# Altium schematic sheet ATB-Display.SchDoc
size A4
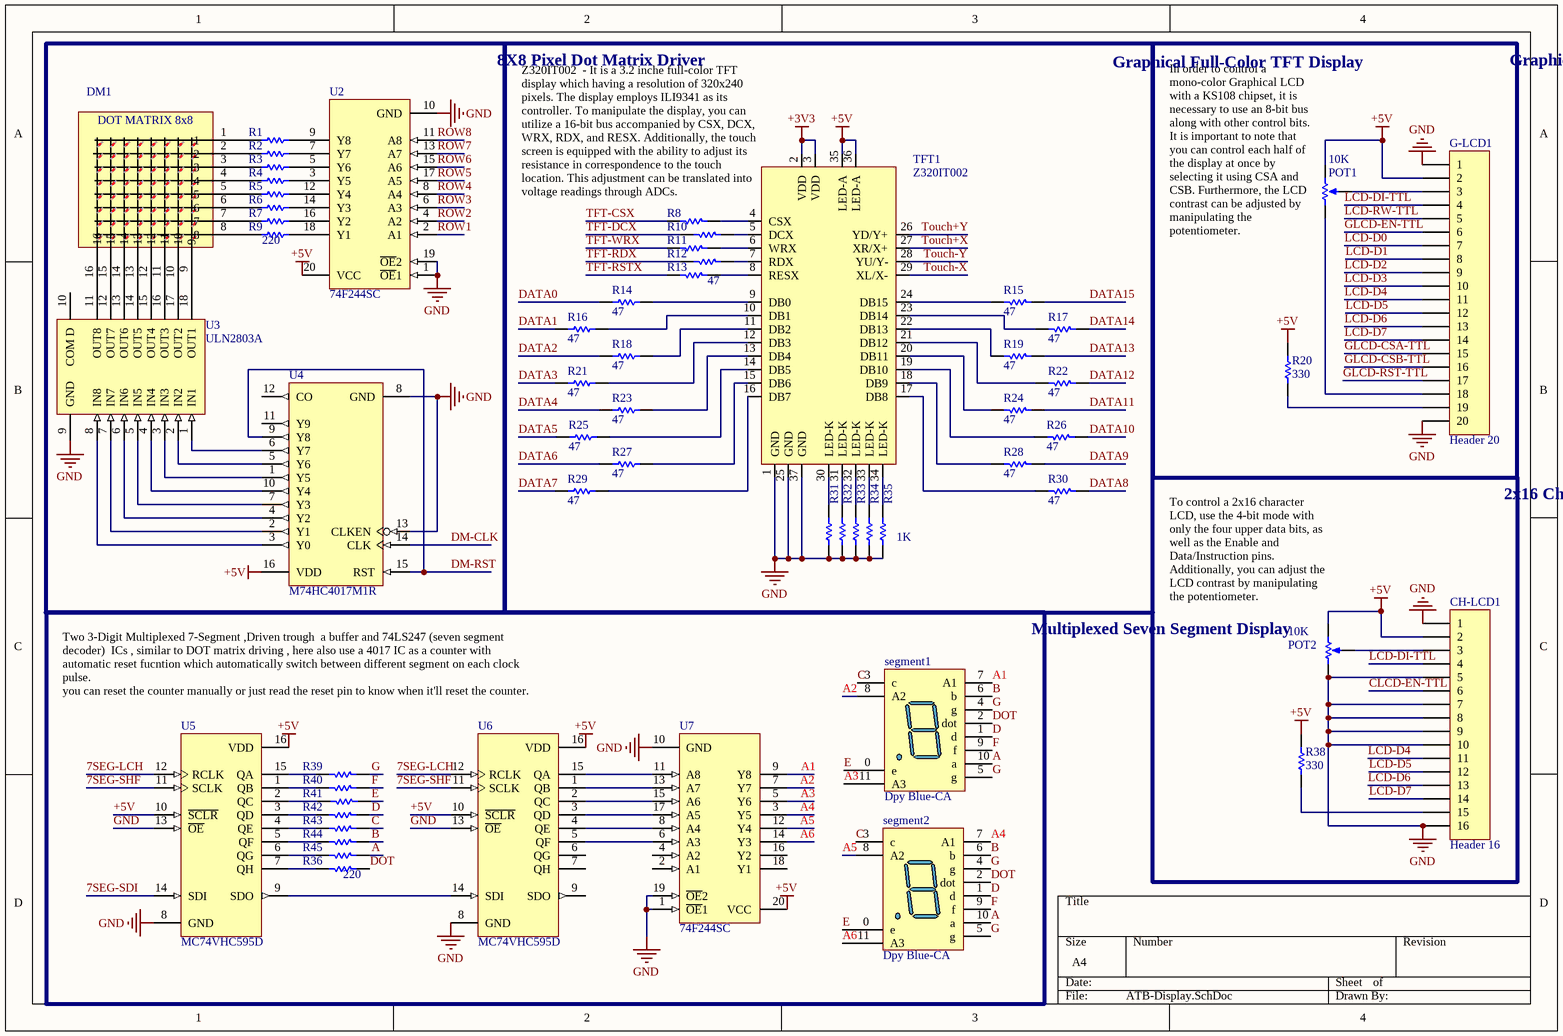
[diagram p0: ATB-Display.SchDoc]

## Parts
CH-LCD1  Header 16  [2X16 LCD]
DM1  DOT-8x8-32X32mm  [8x8 LED MATRIX]  (value not drawn)
G-LCD1  Header 20  [LCD-128X64-ST7920]
POT1  value 10K  [VR5]  (hidden comment: RPot)
POT2  value 10K  [VR5]  (hidden comment: RPot)
R1  220  [SMD_R0805]  (value not drawn)
R2  220  [SMD_R0805]  (value not drawn)
R3  220  [SMD_R0805]  (value not drawn)
R4  220  [SMD_R0805]  (value not drawn)
R5  220  [SMD_R0805]  (value not drawn)
R6  220  [SMD_R0805]  (value not drawn)
R7  220  [SMD_R0805]  (value not drawn)
R8  47  [SMD_R0805]
R9  220  [SMD_R0805]
R10  47  [SMD_R0805]  (value not drawn)
R11  47  [SMD_R0805]  (value not drawn)
R12  47  [SMD_R0805]  (value not drawn)
R13  47  [SMD_R0805]  (value not drawn)
R14  47  [SMD_R0805]
R15  47  [SMD_R0805]
R16  47  [SMD_R0805]
R17  47  [SMD_R0805]
R18  47  [SMD_R0805]
R19  47  [SMD_R0805]
R20  330  [SMD_R1206]
R21  47  [SMD_R0805]
R22  47  [SMD_R0805]
R23  47  [SMD_R0805]
R24  47  [SMD_R0805]
R25  47  [SMD_R0805]
R26  47  [SMD_R0805]
R27  47  [SMD_R0805]
R28  47  [SMD_R0805]
R29  47  [SMD_R0805]
R30  47  [SMD_R0805]
R31  1K  [SMD_R0805]  (value not drawn)
R32  1K  [SMD_R0805]  (value not drawn)
R33  1K  [SMD_R0805]  (value not drawn)
R34  1K  [SMD_R0805]  (value not drawn)
R35  1K  [SMD_R0805]
R36  220  [SMD_R0805]  (value not drawn)
R38  330  [SMD_R1206]
R39  220  [SMD_R0805]  (value not drawn)
R40  220  [SMD_R0805]  (value not drawn)
R41  220  [SMD_R0805]  (value not drawn)
R42  220  [SMD_R0805]  (value not drawn)
R43  220  [SMD_R0805]  (value not drawn)
R44  220  [SMD_R0805]
R45  220  [SMD_R0805]  (value not drawn)
segment1  Dpy Blue-CA  [7 segment Diode]
segment2  Dpy Blue-CA  [7 segment Diode]
TFT1  Z320IT002  [N96 COLOR LCD]
U2  74F244SC  [751D-04_N]
U3  ULN2803A  [so18_n]
U4  M74HC4017M1R  [SO16_N]
U5  MC74VHC595D  [751B-05_N]
U6  MC74VHC595D  [751B-05_N]
U7  74F244SC  [751D-04_N]

## Blocks framed on the sheet
8X8 Pixel Dot Matrix Driver: DM1 R1-R7 R9 U2-U4
Graphical Full-Color TFT Display: R8 R10-R19 R21-R35 TFT1
Graphical Mono Color LCD: G-LCD1 POT1 R20
Multiplexed Seven Segment Display: R36 R39-R45 segment1 segment2 U5-U7

## Nets
+3V3: TFT1.2(VDD) TFT1.3(VDD)
+5V: CH-LCD1.2 G-LCD1.2 POT1.2(BOT) POT2.2(BOT) R20.2 R38.2 TFT1.35(LED-A) TFT1.36(LED-A) U2.20(VCC) U4.16(VDD) U5.10(~{SCLR}) U5.16(VDD) U6.10(~{SCLR}) U6.16(VDD) U7.20(VCC)
GND: CH-LCD1.1 CH-LCD1.5 CH-LCD1.7 CH-LCD1.8 CH-LCD1.9 CH-LCD1.10 CH-LCD1.16 G-LCD1.1 G-LCD1.20 POT2.1(TOP) R31.2 R32.2 R33.2 R34.2 R35.2 TFT1.1(GND) TFT1.25(GND) TFT1.37(GND) U2.1(~{OE}1) U2.10(GND) U2.19(~{OE}2) U3.9(GND) U4.8(GND) U4.13(CLKEN) U5.8(GND) U5.13(~{OE}) U6.8(GND) U6.13(~{OE}) U7.1(~{OE}1) U7.10(GND) U7.19(~{OE}2)
7SEG-LCH: U5.12(RCLK) U6.12(RCLK)
7SEG-SDI: U5.14(SDI)
7SEG-SHF: U5.11(SCLK) U6.11(SCLK)
A: R45.1 segment1.10(a) segment2.10(a)
A1: segment1.7(A1) U7.9(Y8)
A2: segment1.8(A2) U7.7(Y7)
A3: segment1.11(A3) U7.5(Y6)
A4: segment2.7(A1) U7.3(Y5)
A5: segment2.8(A2) U7.12(Y4)
A6: segment2.11(A3) U7.14(Y3)
B: R44.2 segment1.6(b) segment2.6(b)
C: R43.2 segment1.3(c) segment2.3(c)
CLCD-EN-TTL: CH-LCD1.6
D: R42.2 segment1.1(d) segment2.1(d)
DATA0: R14.2
DATA1: R16.2
DATA2: R18.2
DATA3: R21.2
DATA4: R23.2
DATA5: R25.1
DATA6: R27.1
DATA7: R29.1
DATA8: R30.1
DATA9: R28.1
DATA10: R26.1
DATA11: R24.2
DATA12: R22.2
DATA13: R19.2
DATA14: R17.2
DATA15: R15.2
DM-CLK: U4.14(CLK)
DM-RST: U4.9(Y8) U4.15(RST)
DOT: R36.1 segment1.2(dot) segment2.2(dot)
E: R41.2 segment1.0(e) segment2.0(e)
F: R40.2 segment1.9(f) segment2.9(f)
G: R39.2 segment1.4(g) segment1.5(g) segment2.4(g) segment2.5(g)
GLCD-CSA-TTL: G-LCD1.15
GLCD-CSB-TTL: G-LCD1.16
GLCD-EN-TTL: G-LCD1.6
GLCD-RST-TTL: G-LCD1.17
LCD-D0: G-LCD1.7
LCD-D1: G-LCD1.8
LCD-D2: G-LCD1.9
LCD-D3: G-LCD1.10
LCD-D4: CH-LCD1.11 G-LCD1.11
LCD-D5: CH-LCD1.12 G-LCD1.12
LCD-D6: CH-LCD1.13 G-LCD1.13
LCD-D7: CH-LCD1.14 G-LCD1.14
LCD-DI-TTL: CH-LCD1.4 G-LCD1.4
LCD-RW-TTL: G-LCD1.5
ROW1: U2.2(A1)
ROW2: U2.4(A2)
ROW3: U2.6(A3)
ROW4: U2.8(A4)
ROW5: U2.17(A5)
ROW6: U2.15(A6)
ROW7: U2.13(A7)
ROW8: U2.11(A8)
TFT-CSX: R8.2
TFT-DCX: R10.2
TFT-RDX: R12.2
TFT-RSTX: R13.2
TFT-WRX: R11.2
Touch+X: TFT1.27(XR/X+)
Touch+Y: TFT1.26(YD/Y+)
Touch-X: TFT1.29(XL/X-)
Touch-Y: TFT1.28(YU/Y-)
NetCH-LCD1_3: CH-LCD1.3 POT2.3(TAP)
NetCH-LCD1_15: CH-LCD1.15 R38.1
NetDM1_1: DM1.1 R1.1
NetDM1_2: DM1.2 R2.1
NetDM1_3: DM1.3 R3.1
NetDM1_4: DM1.4 R4.1
NetDM1_5: DM1.5 R5.1
NetDM1_6: DM1.6 R6.1
NetDM1_7: DM1.7 R7.1
NetDM1_8: DM1.8 R9.1
NetDM1_9: DM1.9 U3.18(OUT1)
NetDM1_10: DM1.10 U3.17(OUT2)
NetDM1_11: DM1.11 U3.16(OUT3)
NetDM1_12: DM1.12 U3.15(OUT4)
NetDM1_13: DM1.13 U3.14(OUT5)
NetDM1_14: DM1.14 U3.13(OUT6)
NetDM1_15: DM1.15 U3.12(OUT7)
NetDM1_16: DM1.16 U3.11(OUT8)
NetG-LCD1_3: G-LCD1.3 POT1.3(TAP)
NetG-LCD1_18: G-LCD1.18 POT1.1(TOP)
NetG-LCD1_19: G-LCD1.19 R20.1
NetR1_2: R1.2 U2.9(Y8)
NetR2_2: R2.2 U2.7(Y7)
NetR3_2: R3.2 U2.5(Y6)
NetR4_2: R4.2 U2.3(Y5)
NetR5_2: R5.2 U2.12(Y4)
NetR6_2: R6.2 U2.14(Y3)
NetR7_2: R7.2 U2.16(Y2)
NetR8_1: R8.1 TFT1.4(CSX)
NetR9_2: R9.2 U2.18(Y1)
NetR10_1: R10.1 TFT1.5(DCX)
NetR11_1: R11.1 TFT1.6(WRX)
NetR12_1: R12.1 TFT1.7(RDX)
NetR13_1: R13.1 TFT1.8(RESX)
NetR14_1: R14.1 TFT1.9(DB0)
NetR15_1: R15.1 TFT1.24(DB15)
NetR16_1: R16.1 TFT1.10(DB1)
NetR17_1: R17.1 TFT1.23(DB14)
NetR18_1: R18.1 TFT1.11(DB2)
NetR19_1: R19.1 TFT1.22(DB13)
NetR21_1: R21.1 TFT1.12(DB3)
NetR22_1: R22.1 TFT1.21(DB12)
NetR23_1: R23.1 TFT1.13(DB4)
NetR24_1: R24.1 TFT1.20(DB11)
NetR25_2: R25.2 TFT1.14(DB5)
NetR26_2: R26.2 TFT1.19(DB10)
NetR27_2: R27.2 TFT1.15(DB6)
NetR28_2: R28.2 TFT1.18(DB9)
NetR29_2: R29.2 TFT1.16(DB7)
NetR30_2: R30.2 TFT1.17(DB8)
NetR31_1: R31.1 TFT1.30(LED-K)
NetR32_1: R32.1 TFT1.31(LED-K)
NetR33_1: R33.1 TFT1.32(LED-K)
NetR34_1: R34.1 TFT1.33(LED-K)
NetR35_1: R35.1 TFT1.34(LED-K)
NetR36_2: R36.2 U5.7(QH)
NetR39_1: R39.1 U5.15(QA)
NetR40_1: R40.1 U5.1(QB)
NetR41_1: R41.1 U5.2(QC)
NetR42_1: R42.1 U5.3(QD)
NetR43_1: R43.1 U5.4(QE)
NetR44_1: R44.1 U5.5(QF)
NetR45_2: R45.2 U5.6(QG)
NetU3_1: U3.1(IN1) U4.6(Y7)
NetU3_2: U3.2(IN2) U4.5(Y6)
NetU3_3: U3.3(IN3) U4.1(Y5)
NetU3_4: U3.4(IN4) U4.10(Y4)
NetU3_5: U3.5(IN5) U4.7(Y3)
NetU3_6: U3.6(IN6) U4.4(Y2)
NetU3_7: U3.7(IN7) U4.2(Y1)
NetU3_8: U3.8(IN8) U4.3(Y0)
NetU5_9: U5.9(SDO) U6.14(SDI)
NetU6_1: U6.1(QB) U7.13(A7)
NetU6_2: U6.2(QC) U7.15(A6)
NetU6_3: U6.3(QD) U7.17(A5)
NetU6_4: U6.4(QE) U7.8(A4)
NetU6_5: U6.5(QF) U7.6(A3)
NetU6_15: U6.15(QA) U7.11(A8)

Not connected (* = marked no-connect by the designer): U3 10(COM_D); U4 11(Y9) 12(CO); U6 6(QG) 7(QH) 9(SDO); U7 2(A1) 4(A2) 16(Y2) 18(Y1)

## Notes on the sheet
- (near TFT1) Z320IT002  - It is a 3.2 inche full-color TFT display which having a resolution of 320x240 pixels. The display employs ILI9341 as its controller. To manipulate the display, you can utilize a 16-bit bus accompanied by CSX, DCX, WRX, RDX, and RESX. Additionally, the touch screen is equipped with the ability to adjust its resistance in correspondence to the touch location. This adjustment can be translated into voltage readings through ADCs.
- (near POT1) In order to control a mono-color Graphical LCD with a KS108 chipset, it is necessary to use an 8-bit bus along with other control bits. It is important to note that you can control each half of the display at once by selecting it using CSA and CSB. Furthermore, the LCD contrast can be adjusted by manipulating the potentiometer.
- 2x16 Character LCD
- (near POT2) To control a 2x16 character LCD, use the 4-bit mode with only the four upper data bits, as well as the Enable and Data/Instruction pins. Additionally, you can adjust the LCD contrast by manipulating the potentiometer.
- Two 3-Digit Multiplexed 7-Segment ,Driven trough  a buffer and 74LS247 (seven segment decoder)  ICs , similar to DOT matrix driving , here also use a 4017 IC as a counter with automatic reset fucntion which automatically switch between different segment on each clock pulse.
  you can reset the counter manually or just read the reset pin to know when it'll reset the counter.
- (in symbol 8X8-DOT MATRIX LED) DOT MATRIX 8x8

## Library data of the parts
CH-LCD1 = Header 16: Header, 16-Pin; LatestRevisionDate: 17-Jul-2002; LatestRevisionNote: Re-released for DXP Platform.; Publisher: Altium Limited
DM1 = 8X8-DOT MATRIX LED
G-LCD1 = Header 20: Header, 20-Pin; LatestRevisionDate: 17-Jul-2002; LatestRevisionNote: Re-released for DXP Platform.; Publisher: Altium Limited
POT1 POT2 = RPot: Potentiometer; pin to pad: 1>3 2>1 3>2; Sim Note: Enter the Resistance value and the set point into parameter fields.; Set Position: 0.5; Published: 8-Jun-2000; LatestRevisionDate: 17-Jul-2002; LatestRevisionNote: Re-released for DXP Platform.; PackageReference: VR5; Publisher: Altium Limited
R1-R36 R38-R45 = Res1: Resistor; Published: 8-Jun-2000; LatestRevisionDate: 17-Jul-2002; LatestRevisionNote: Re-released for DXP Platform.; PackageReference: AXIAL-0.3; Publisher: Altium Limited
  R1-R7 R9 R36 R39-R45: Value: 220
  R8 R10-R19 R21-R30: Value: 47
  R20 R38: Value: 330
  R31-R35: Value: 1K
segment1 segment2 = Dpy Blue-CA: 14.2 mm General Purpose Blue 7-Segment Display: CA, RH DP, Gray Surface; Package Information: Latest Revision: 24-Sep-2002; Min. Intensity: 2020 ucd; Note: IF = 10 mA; Note: Pins 3 and 8 are redundant Anodes.; Datasheet: Latest Revision: 24-Sep-2002; Package Reference: H; Publisher: Altium Limited; Colour: Blue
TFT1 = TFT-Z320IT002: Size: 3.2 inches / Resolution: 240(H) X 320(V) RGB / Control Chip: ILI9341 / Display Color: Full-Color / Interface Type: 16bits Parallel interface
U2 U7 = 74F244SC: Octal Buffer/Line Driver with Tri-State Output; Published: 15-Apr-2002; LatestRevisionDate: 13-Apr-2006; LatestRevisionNote: IPC-7351 Footprint Added.; DatasheetVersion: May-1995; PackageVersion: 2000; PackageReference: M20B; Publisher: Altium Limited; PackageDescription: 20-Pin Small Outline Integrated Circuit 1.27 mm Pitch; Code_JEDEC: MS-013-AC; Code_IPC: SOIC127P1030-20; ComponentLink1Description: Manufacturer Link; ComponentLink1URL: http://www.national.com/; ComponentLink2Description: Datasheet; ComponentLink2URL: http://www.fairchildsemi.com/ds/74/74F244.pdf; ComponentLink3Description: URL Link1; ComponentLink3URL: http://www.fairchildsemi.com/pf/74/74F244.html
U3 = ULN2803A: Eight Darlington Array; Published: 8-Jun-2000; LatestRevisionDate: 06-Jun-2005; LatestRevisionNote: Stylized 3D Model Added.; DatasheetVersion: Sep-1997; PackageReference: DIP18; Publisher: Altium Limited; PackageDescription: DIP; 18 Leads; Row Spacing 7.62 mm; Pitch 2.54 mm; ComponentLink1Description: Manufacturer Link; ComponentLink1URL: http://www.st.com/; ComponentLink2Description: Datasheet; ComponentLink2URL: http://www.st.com/stonline/products/literature/ds/1536/uln2801a.pdf
U4 = M74HC4017M1R: Decade Counter/Divider; Published: 8-Jun-2000; LatestRevisionDate: 13-Apr-2006; LatestRevisionNote: IPC-7351 Footprint Added.; DatasheetVersion: Oct-1992; PackageVersion: May-1998; PackageReference: SO16; Publisher: Altium Limited; PackageDescription: 16-Pin Small Outline Integrated Circuit 1.27 mm Pitch; Code_IPC: SOIC127P600-16; ComponentLink1Description: Manufacturer Link; ComponentLink1URL: http://www.st.com/; ComponentLink2Description: Datasheet; ComponentLink2URL: http://www.st.com/stonline/products/literature/ds/1960/m74hc4017.pdf
U5 U6 = MC74VHC595D: 8-Bit 3-State Shift Register with Output Storage Register; ComponentAvailability: Not for New Design; Published: 15-Apr-2002; LatestRevisionDate: 13-Apr-2006; LatestRevisionNote: IPC-7351 Footprint Added.; DatasheetVersion: 1997; PackageVersion: Oct-1999; PackageReference: 751B-05; Publisher: Altium Limited; PackageDescription: 16-Pin Small Outline Integrated Circuit 1.27 mm Pitch; Code_JEDEC: MS-012-AC; Code_IPC: SOIC127P600-16; ComponentLink1Description: Manufacturer Link; ComponentLink1URL: http://www.onsemi.com/; ComponentLink2Description: Datasheet; ComponentLink2URL: http://www.onsemi.com/pub/Collateral/MC74VHC595-D.PDF